# Altium schematic sheet [10] - Isolation.SchDoc
size A3
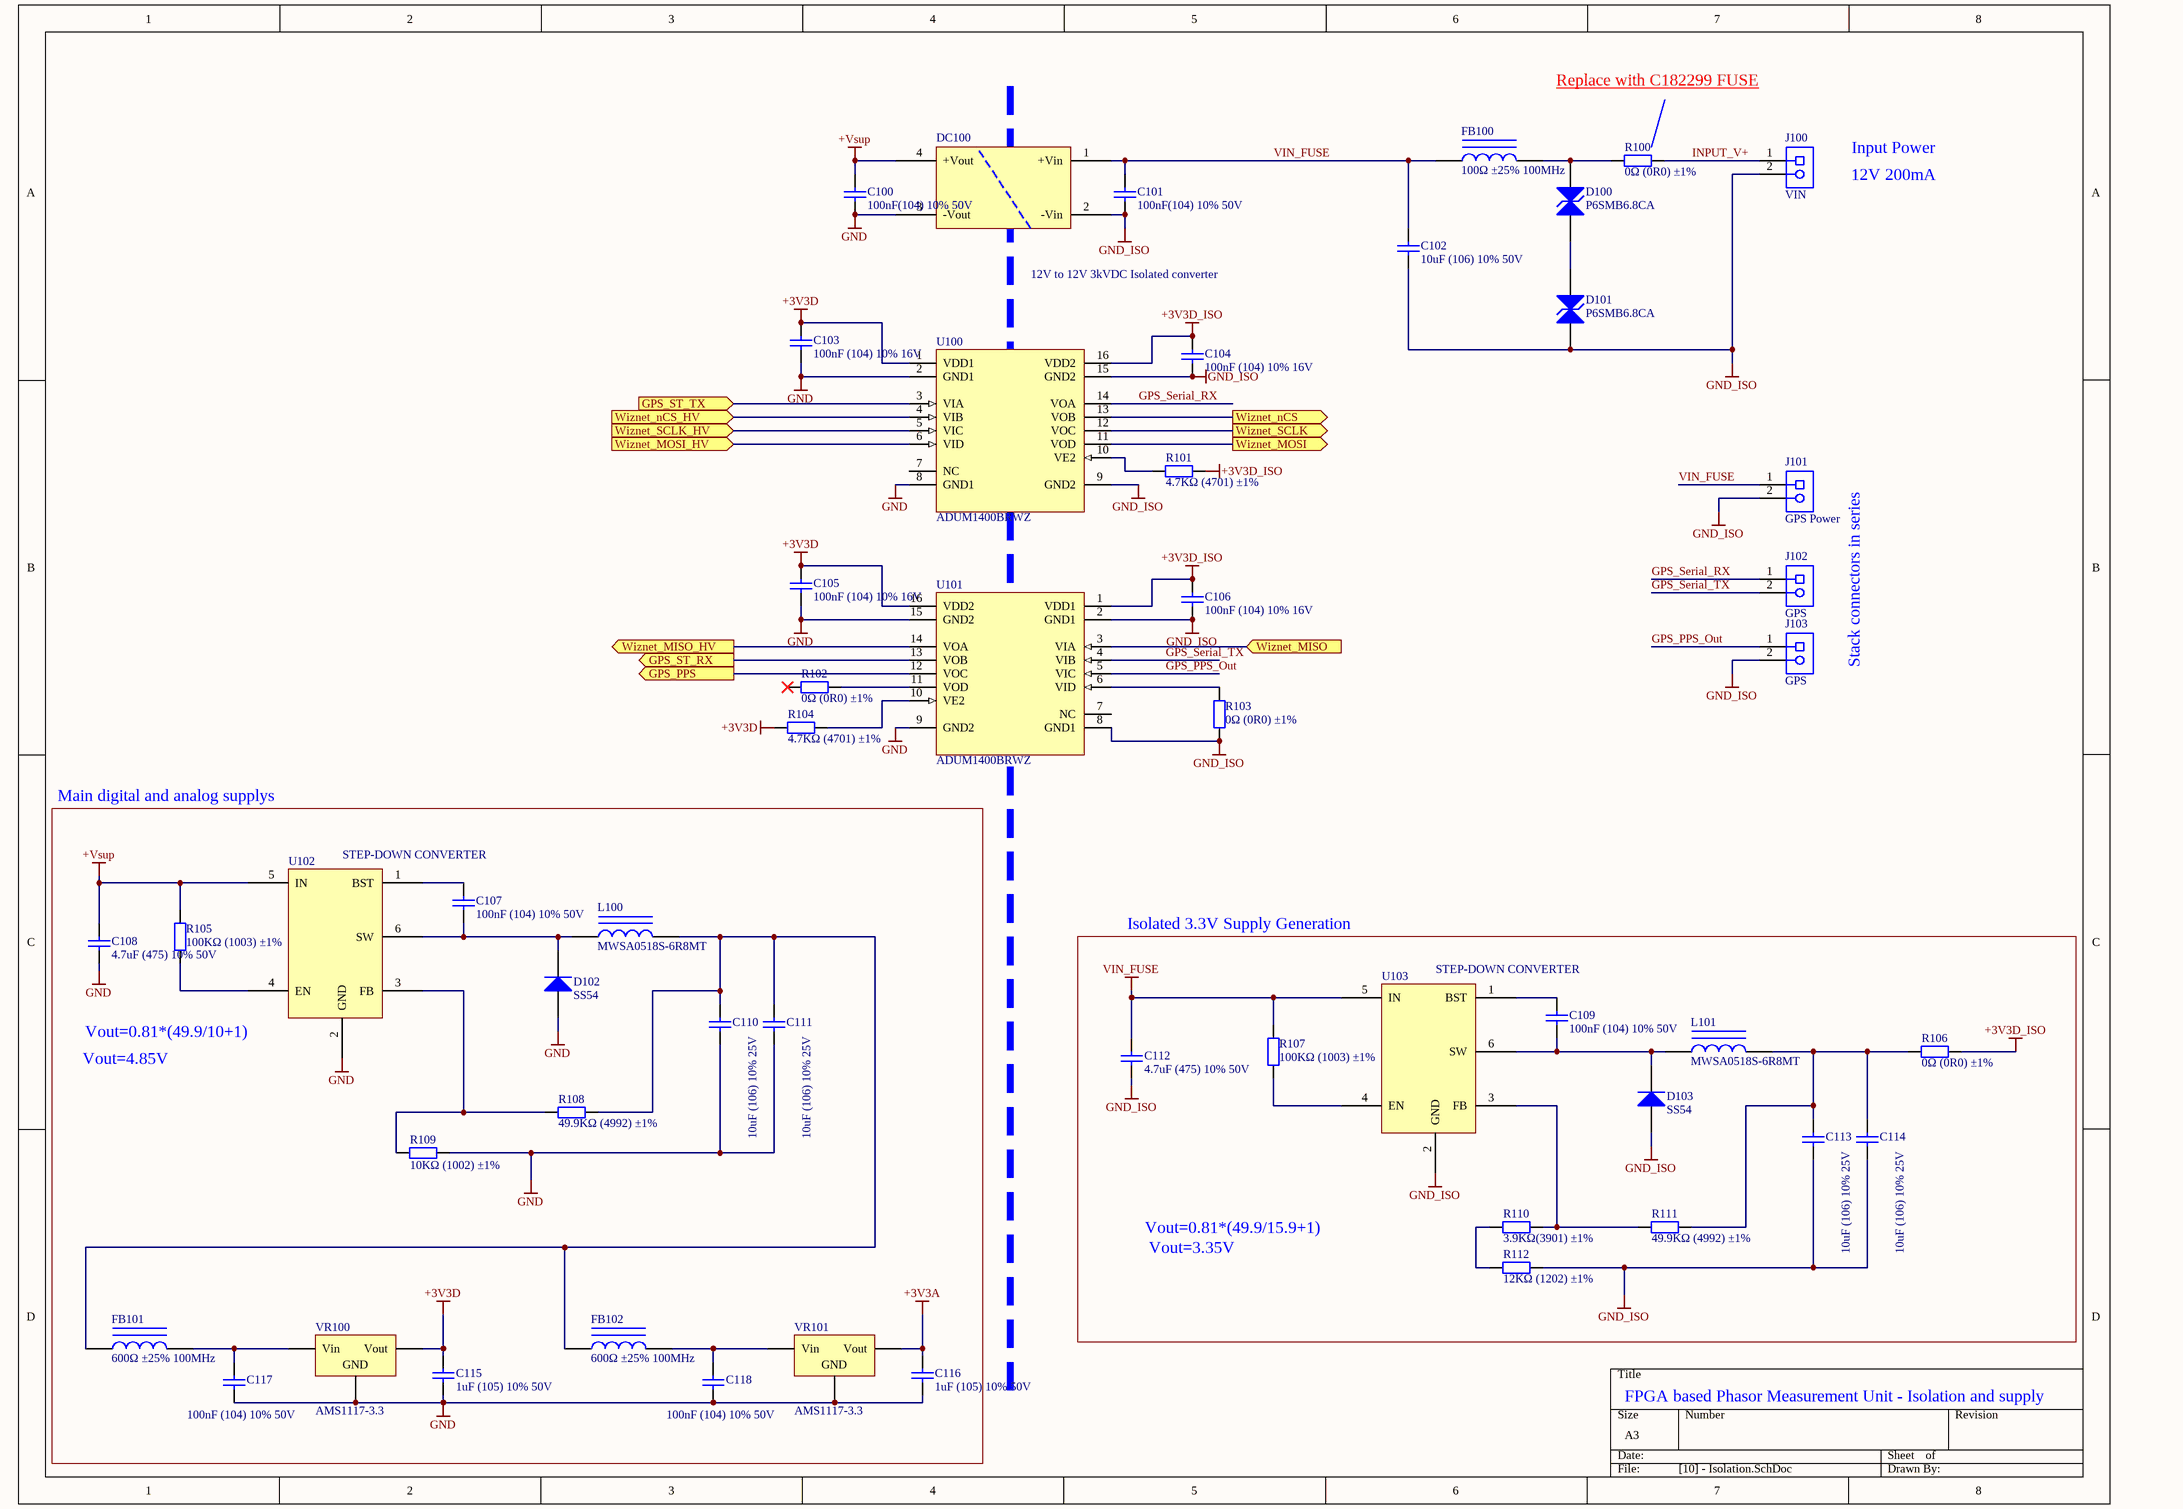
[diagram p0: [10] - Isolation.SchDoc]

## Parts
C100  100nF(104) 10% 50V  [0805_C]
C101  100nF(104) 10% 50V  [0805_C]
C102  10uF (106) 10% 50V  [1206_C]
C103  100nF (104) 10% 16V  [0402_C]
C104  100nF (104) 10% 16V  [0402_C]
C105  100nF (104) 10% 16V  [0402_C]
C106  100nF (104) 10% 16V  [0402_C]
C107  100nF (104) 10% 50V  [0603_C]
C108  4.7uF (475) 10% 50V  [1206_C]
C109  100nF (104) 10% 50V  [0603_C]
C110  10uF (106) 10% 25V  [0805_C]
C111  10uF (106) 10% 25V  [0805_C]
C112  4.7uF (475) 10% 50V  [1206_C]
C113  10uF (106) 10% 25V  [0805_C]
C114  10uF (106) 10% 25V  [0805_C]
C115  1uF (105) 10% 50V  [0603_C]
C116  1uF (105) 10% 50V  [0603_C]
C117  100nF (104) 10% 50V  [0603_C]
C118  100nF (104) 10% 50V  [0603_C]
D100  P6SMB6.8CA  [SMB(DO-214AA)_S1]
D101  P6SMB6.8CA  [SMB(DO-214AA)_S1]
D102  SS54  [SMA(DO-214AC)_S1]
D103  SS54  [SMA(DO-214AC)_S1]
DC100  12V to 12V 3kVDC Isolated converter  [SPI-7 DC DC]
FB100  100Ω ±25% 100MHz  [0805_L]
FB101  600Ω ±25% 100MHz  [0805_L]
FB102  600Ω ±25% 100MHz  [0805_L]
J100  VIN  [PHOE-1729128-2_V]
J101  GPS Power  [PHOE-1729128-2_V]
J102  GPS  [PHOE-1729128-2_V]
J103  GPS  [PHOE-1729128-2_V]
L100  MWSA0518S-6R8MT  [MWSA0518]
L101  MWSA0518S-6R8MT  [MWSA0518]
R100  0Ω (0R0) ±1%  [0603_R]
R101  4.7KΩ (4701) ±1%  [0402_R]
R102  0Ω (0R0) ±1%  [0402_R]
R103  0Ω (0R0) ±1%  [0402_R]
R104  4.7KΩ (4701) ±1%  [0402_R]
R105  100KΩ (1003) ±1%  [0402_R]
R106  0Ω (0R0) ±1%  [0805_R]
R107  100KΩ (1003) ±1%  [0402_R]
R108  49.9KΩ (4992) ±1%  [0402_R]
R109  10KΩ (1002) ±1%  [0402_R]
R110  3.9KΩ(3901) ±1%  [0402_R]
R111  49.9KΩ (4992) ±1%  [0402_R]
R112  12KΩ (1202) ±1%  [0402_R]
U100  ADUM1400BRWZ  [ADI-RW-16_L]
U101  ADUM1400BRWZ  [ADI-RW-16_L]
U102  STEP-DOWN CONVERTER  [*TSOT-23_S6]
U103  STEP-DOWN CONVERTER  [*TSOT-23_S6]
VR100  AMS1117-3.3  [SOT-223]
VR101  AMS1117-3.3  [SOT-223]

## Ports
GPS_PPS (out), GPS_ST_RX (out), GPS_ST_TX (in), Wiznet_MISO (in), Wiznet_MISO_HV (out), Wiznet_MOSI (out), Wiznet_MOSI_HV (in), Wiznet_nCS (out), Wiznet_nCS_HV (in), Wiznet_SCLK (out), Wiznet_SCLK_HV (in)

## Nets
+3V3A: C116.2 VR101.2(Vout)
+3V3D: C103.2 C105.2 C115.2 R104.1 U100.1(VDD1) U101.16(VDD2) VR100.2(Vout)
+3V3D_ISO: C104.2 C106.2 R101.2 R106.2 U100.16(VDD2) U101.1(VDD1)
+Vsup: C100.2 C108.2 DC100.4(+Vout) R105.2 U102.5(IN)
GND: C100.1 C103.1 C105.1 C108.1 C110.1 C111.1 C115.1 C116.1 C117.1 C118.1 D102.1(A) DC100.3(-Vout) R109.2 U100.2(GND1) U100.8(GND1) U101.9(GND2) U101.15(GND2) U102.2(GND) VR100.1(GND) VR101.1(GND)
GND_ISO: C101.1 C102.1 C104.1 C106.1 C112.1 C113.1 C114.1 D101.1(A) D103.1(A) DC100.2(-Vin) J100.2 J101.2 J103.2 R103.1 R112.2 U100.9(GND2) U100.15(GND2) U101.2(GND1) U101.8(GND1) U103.2(GND)
VIN_FUSE: C101.2 C102.2 C112.2 DC100.1(+Vin) FB100.1 J101.1 R107.2 U103.5(IN)
GPS_PPS: U101.12(VOC) ; port GPS_PPS
GPS_PPS_Out: J103.1 U101.5(VIC)
GPS_Serial_RX: J102.1 U100.14(VOA)
GPS_Serial_TX: J102.2 U101.4(VIB)
GPS_ST_RX: U101.13(VOB) ; port GPS_ST_RX
GPS_ST_TX: U100.3(VIA) ; port GPS_ST_TX
INPUT_V+: J100.1 R100.2
Wiznet_MISO: U101.3(VIA) ; port Wiznet_MISO
Wiznet_MISO_HV: U101.14(VOA) ; port Wiznet_MISO_HV
Wiznet_MOSI: U100.11(VOD) ; port Wiznet_MOSI
Wiznet_MOSI_HV: U100.6(VID) ; port Wiznet_MOSI_HV
Wiznet_nCS: U100.13(VOB) ; port Wiznet_nCS
Wiznet_nCS_HV: U100.4(VIB) ; port Wiznet_nCS_HV
Wiznet_SCLK: U100.12(VOC) ; port Wiznet_SCLK
Wiznet_SCLK_HV: U100.5(VIC) ; port Wiznet_SCLK_HV
NetC107_1: C107.1 D102.2(K) L100.1 U102.6(SW)
NetC107_2: C107.2 U102.1(BST)
NetC109_1: C109.1 D103.2(K) L101.1 U103.6(SW)
NetC109_2: C109.2 U103.1(BST)
NetC110_2: C110.2 C111.2 FB101.1 FB102.1 L100.2 R108.2
NetC113_2: C113.2 C114.2 L101.2 R106.1 R111.2
NetC117_2: C117.2 FB101.2 VR100.3(Vin)
NetC118_2: C118.2 FB102.2 VR101.3(Vin)
NetD100_1: D100.1(A) D101.2(K)
NetD100_2: D100.2(K) FB100.2 R100.1
NetR101_1: R101.1 U100.10(VE2)
NetR102_1: R102.1 U101.11(VOD)
NetR103_2: R103.2 U101.6(VID)
NetR104_2: R104.2 U101.10(VE2)
NetR105_1: R105.1 U102.4(EN)
NetR107_1: R107.1 U103.4(EN)
NetR108_1: R108.1 R109.1 U102.3(FB)
NetR110_1: R110.1 R112.1
NetR110_2: R110.2 R111.1 U103.3(FB)

Not connected (* = marked no-connect by the designer): R102 2*; U100 7(NC); U101 7(NC)

## Notes on the sheet
- Replace with C182299 FUSE
- Input Power
- 12V 200mA
- Stack connectors in series
- Main digital and analog supplys
- Isolated 3.3V Supply Generation
- Vout=4.85V
- (near U102) Vout=0.81*(49.9/10+1)
- Vout=3.35V
- Vout=0.81*(49.9/15.9+1)
- FPGA based Phasor Measurement Unit - Isolation and supply

## Library data of the parts
C100 C101 = 0805 100nF(104) 10% 50V: 贴片电容; ComponentLink1Description: 供应商链接; ComponentLink1URL: http://www.szlcsc.com/product/details_50686.html; Package: 0805; Supplier: LC; SuppliersPartNumber: C49678
C102 = 1206 10uF (106) 10% 50V: 贴片电容; ComponentLink1Description: 供应商链接; ComponentLink1URL: http://www.szlcsc.com/product/details_14236.html; Package: 1206; Supplier: LC; SuppliersPartNumber: C13585
C103-C106 = 0402 100nF (104) 10% 16V: 贴片电容; ComponentLink1Description: 供应商链接; ComponentLink1URL: http://www.szlcsc.com/product/details_1877.html; Package: 0402; Supplier: LC; SuppliersPartNumber: C1525
C107 C109 C117 C118 = 0603 100nF (104) 10% 50V: 贴片电容; ComponentLink1Description: 供应商链接; ComponentLink1URL: http://www.szlcsc.com/product/details_15331.html; Package: 0603; Supplier: LC; SuppliersPartNumber: C14663
C108 C112 = 1206 4.7uF (475) 10% 50V: 贴片电容; ComponentLink1Description: 供应商链接; ComponentLink1URL: http://www.szlcsc.com/product/details_30577.html; Package: 1206; Supplier: LC; SuppliersPartNumber: C29823
C110 C111 C113 C114 = 0805 10uF (106) 10% 25V: 贴片电容; ComponentLink1Description: 供应商链接; ComponentLink1URL: http://www.szlcsc.com/product/details_16532.html; Package: 0805; Supplier: LC; SuppliersPartNumber: C15850
C115 C116 = 0603 1uF (105) 10% 50V: 贴片电容; ComponentLink1Description: 供应商链接; ComponentLink1URL: http://www.szlcsc.com/product/details_16531.html; Package: 0603; Supplier: LC; SuppliersPartNumber: C15849
D100 D101 = SMB/DO-214AA P6SMB6.8CA: TVS; ComponentLink1Description: 供应商链接; ComponentLink1URL: http://www.szlcsc.com/product/details_79530.html; Package: SMB/DO-214AA; Supplier: LC; SuppliersPartNumber: C78395
D102 D103 = SMA(DO-214AC) SS54: 二极管; ComponentLink1Description: 供应商链接; ComponentLink1URL: http://www.szlcsc.com/product/details_23178.html; Package: SMA(DO-214AC); Supplier: LC; SuppliersPartNumber: C22452
DC100 = F1212S-2WR2: Isolated DC-DC Converters F_S-2W2R Series -- 2Watt; JLCPCB: NO; SuppliersPartNumber: C495165
FB100 = 0805 100Ω 25% 100MHz: 贴片磁珠; ComponentLink1Description: 供应商链接; ComponentLink1URL: http://www.szlcsc.com/product/details_1367.html; Package: 0805; Supplier: LC; SuppliersPartNumber: C1015
FB101 FB102 = 0805 600Ω 25% 100MHz: 贴片磁珠; ComponentLink1Description: 供应商链接; ComponentLink1URL: http://www.szlcsc.com/product/details_1369.html; Package: 0805; Supplier: LC; SuppliersPartNumber: C1017
J100-J103 = CMP-2000-05815-1: PCB Terminal Block, 13.5 A, 400 V, 2-Pin THD, RoHS, Bulk; PartNumber: 1729128; Manufacturer: Phoenix Contact; Package Version: 03/2015; No. of Rows: 1; Pitch: 5.08mm; No. of Positions: 2; Voltage Rating: 400V; Current Rating: 13500mA; Manufacturer URL: http://www.phoenixcontact.com/; Datasheet URL: https://datasheet.ciiva.com/16046/1729128-16046181.pdf; RoHS: TRUE; Package URL: https://www.phoenixcontact.com/online/portal/pi/pxc/product_detail_page/!ut/p/b1/3VdJjqNKFDxLH8AFycySyWY2ozFsEPOMMQaDOX1XedGL_1Vdm5YXJleknhSKeBkvI6EA8ncAo3AYoDhBQGco6KN7VURTdemj9us_IEKEZo_YHiPAEWEFmDGOHMORkqKYCORBZxgL7ZoaZYcbFFUZ3fqxSY6GOuxydWUuHqz1ynmMFygu583Bob0Ewr6Sd_l-5m-kAueHiB0jpRwZwe58wwtkpxtMYd_LmGcDRU02dRNEyWt6Y2ti5pSyJ_reIkzIulrqApdnbT11V5jnCKbYNCvhEM1MCpPByat_X379-iThf08CI5GfOPqfBeS3BRoBOdD55AKVv0iLwCMq-2BrzXWSGRH7pUGD9uwXQjiph3xL0DKQwdGa0JImiIOmBNOestqgwTHSSs2oOep-78apyXQBvNi8ZLaFjvjWvcaUEBu0MC6Wbe-d6mB0FAebo2lUWinqYaZs5DAYzV0RP9yitUjnGJ0iI9xhZkT42OCQNUJJhkgWINNQLP2JFP6OpMg3JCVg70jqHT0lvKOnhHf0lPuOnnLf0VPuWx6_dxwUIvwk5WMkT0kLL1mh61l2yZVSzG3pYV_bqo-mj6uMKwKwdnnW8Jh5RTOJzMOA5c-eJDaZQw4mTMPH02PvS_ZAqNVjVTo2WyYLkwH_KU1mmmG5kjRhDqPXLwwVHvVOjCM60-fpXvTDfMGW1PVFVS1r4e4yVDk4ZdNbkUHvqPqQSeian4UD39fNKmachqdJ1NJbyk8rXT9mXTvPk3oE5meulKGgiruPJek-4I9hTT6G8ZLOyRSm2RRVbThERQad5OS28hdt4YW4vG0stgYYzsWsK4_7y6DZMjJSCqri1kyiZR5vD7pwIrNR7QwPHTcLTI5qT7eRlpHrdGiupYlqQDJ7zy_CND8fWWBoLRXxk1RVcXiBQwbTD4Xi7KL-FuO94t9xaqweXzH; Package Description: 2-Pin Through Hole Device, Body 8.1 x 10.16 mm, Pitch 5.08 mm; Datasheet Version: 12/2013; Mounting Technology: ThroughHole; Orientation: Horizontal; Package Reference: 1729128-2; Packing: Bulk; JLCPCB: NO
L100 L101 = MWSA0518S-6R8MT: POWER INDUCTORS SMD,5.2X5.4X1.8MM ROHS; Value: 6.8uH; Current Rating: 5.0A; Package: 5.2X5.4X1.8MM; Supplier: LC; SuppliersPartNumber: C408348; ClassName: PowerPads
R100 = 0603 0Ω (0R0) 1%: 贴片电阻; ComponentLink1Description: 供应商链接; ComponentLink1URL: http://www.szlcsc.com/product/details_21903.html; Package: 0603; Supplier: LC; SuppliersPartNumber: C21189
R101 R104 = 0402 4.7KΩ (4701) 1%: 贴片电阻; ComponentLink1Description: 供应商链接; ComponentLink1URL: http://www.szlcsc.com/product/details_26643.html; Package: 0402; Supplier: LC; SuppliersPartNumber: C25900
R102 R103 = 0402 0Ω (0R0) 1%: 贴片电阻; ComponentLink1Description: 供应商链接; ComponentLink1URL: http://www.szlcsc.com/product/details_17853.html; Package: 0402; Supplier: LC; SuppliersPartNumber: C17168
R105 R107 = 0402 100KΩ (1003) 1%: 贴片电阻; ComponentLink1Description: 供应商链接; ComponentLink1URL: http://www.szlcsc.com/product/details_26484.html; Package: 0402; Supplier: LC; SuppliersPartNumber: C25741
R106 = 0805 0Ω (0R0) 1%: 贴片电阻; ComponentLink1Description: 供应商链接; ComponentLink1URL: http://www.szlcsc.com/product/details_18165.html; Package: 0805; Supplier: LC; SuppliersPartNumber: C17477
R108 R111 = 0402 49.9KΩ (4992) 1%: 贴片电阻; ComponentLink1Description: 供应商链接; ComponentLink1URL: http://www.szlcsc.com/product/details_26640.html; Package: 0402; Supplier: LC; SuppliersPartNumber: C25897
R109 = 0402 10KΩ (1002) 1%: 贴片电阻; ComponentLink1Description: 供应商链接; ComponentLink1URL: http://www.szlcsc.com/product/details_26487.html; Package: 0402; Supplier: LC; SuppliersPartNumber: C25744
R110 = 0402 3.9KΩ(3901) 1%: 贴片电阻; ComponentLink1Description: 供应商链接; ComponentLink1URL: http://www.szlcsc.com/product/details_52734.html; Package: 0402; Supplier: LC; SuppliersPartNumber: C51721
R112 = 0402 12KΩ (1202) 1%: 贴片电阻; ComponentLink1Description: 供应商链接; ComponentLink1URL: http://www.szlcsc.com/product/details_26495.html; Package: 0402; Supplier: LC; SuppliersPartNumber: C25752
U100 U101 = ADI-ADUMX400-RX-16: Quad Channel Digital Isolator, 2.5 KV rms Insulation Rating, 10 Mbps Data Rate, 50 ns Delay, Industrial, 16-pin SOIC (RW-16), Tube; Manufacturer: Analog Devices; Max Data Rate: 10Mbps; Insulation Rating (kVrms): 2.5; Mounting Technology: Surface Mount; ComponentLink5Description: URL Link2; PackageReference: RW-16; ComponentLink3Description: Package Specification; Code_JEDEC: MS-013-AA; PartNumber: ADUM1400BRWZ; DatasheetVersion: Rev. H; ComponentLink2Description: Datasheet; ComponentLink4Description: URL Link1; ComponentLink1URL: http://www.analog.com/en/index.html; PackageVersion: 032707-B, 03/2007; Max Operating Temp (degreesC): 125; PackageDescription: 16-Pin Standard Small Outline Package, Body 10.3 x 7.5 mm, Pitch 1.27 mm; ComponentLink1Description: Manufacturer URL; ComponentLink5URL: Reference Circuit:http://www.analog.com/en/interface-isolation/digital-isolators/adum1400/products/product.html#product-recommendations; ComponentLink2URL: http://www.analog.com/static/imported-files/data_sheets/ADuM1400_1401_1402.pdf; ComponentLink4URL: Product URL:http://www.analog.com/en/interface-isolation/digital-isolators/adum1400/products/product.html; ComponentLink3URL: http://www.analog.com/static/imported-files/packages/PKG_PDF/SOIC_WIDE%20%28RW%29/RW_16.pdf; SuppliersPartNumber: C72910
U102 U103 = MP2359: 1.2A, 24V, 1.4MHz STEP-DOWN CONVERTER IN A TSOT23-6; SuppliersPartNumber: C14259; ClassName: PowerPads
VR100 VR101 = SOT-223 AMS1117-3.3: 低压差线性稳压(LDO); ComponentLink1Description: 供应商链接; ComponentLink1URL: http://www.szlcsc.com/product/details_6652.html; Package: SOT-223; Supplier: LC; SuppliersPartNumber: C6186